# Altium schematic sheet PSU.SchDoc
size A4; SheetNumber: 3; SheetTotal: 7; SPICEModelCacheIJFRPAVB: <root> / <DocumentId>IJFRPAVB</DocumentId> / </root>
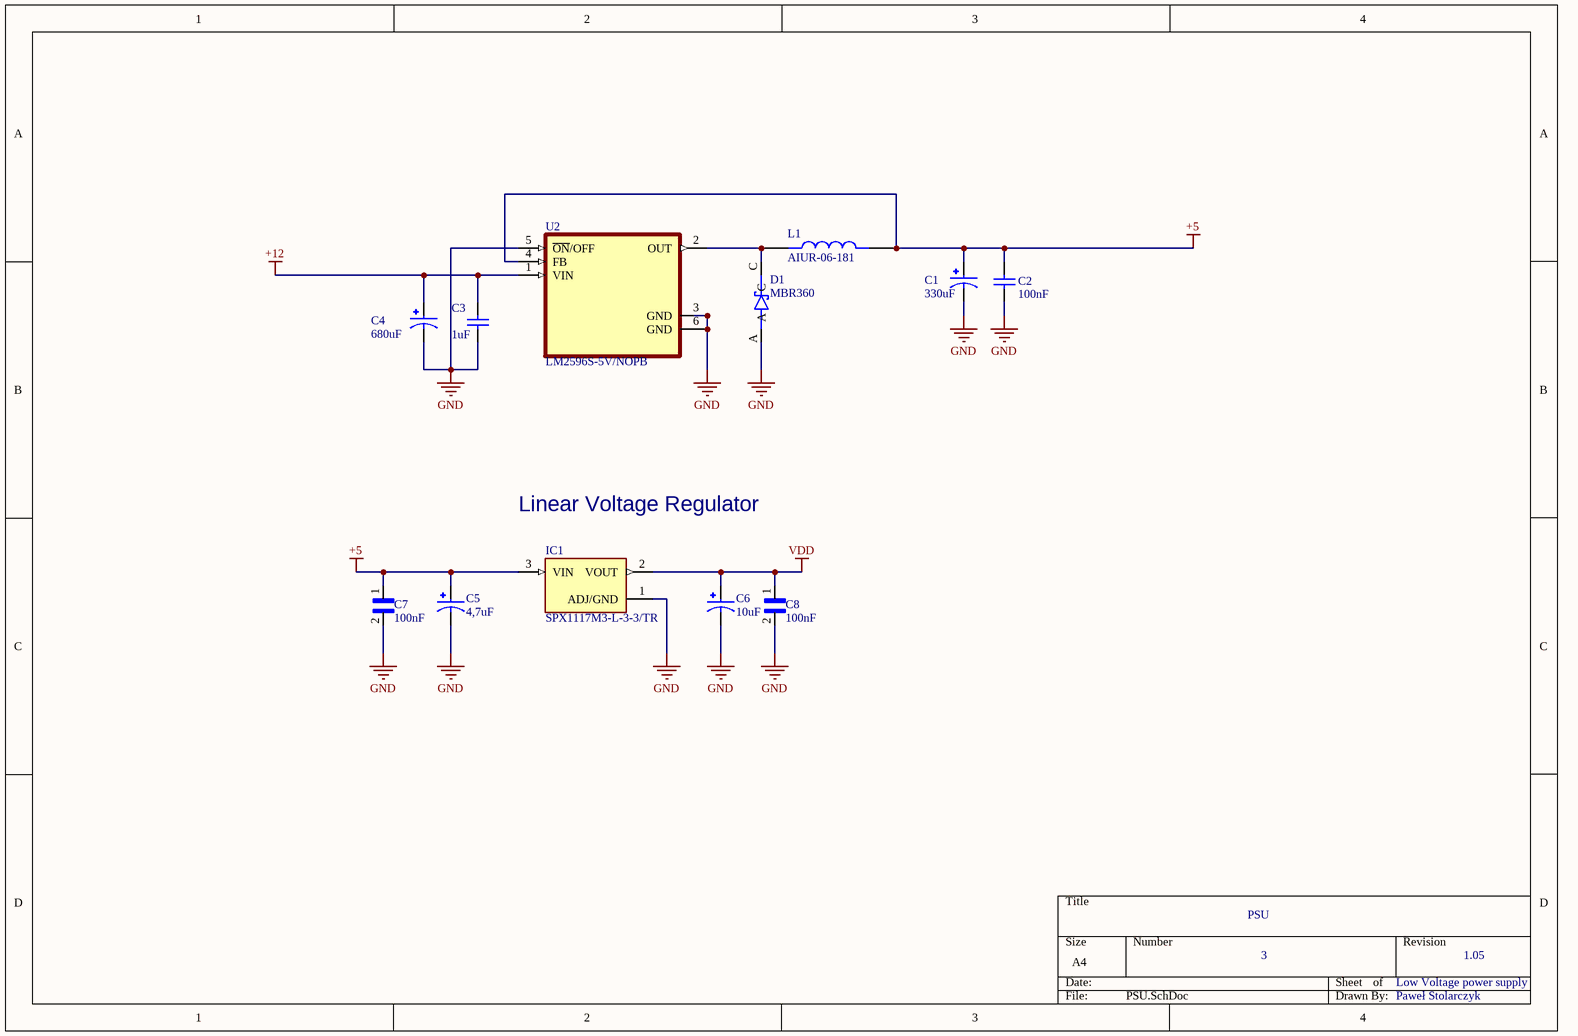
[diagram p0: PSU.SchDoc]

## Parts
C1  330uF  [CAP_16SVP330M]
C2  value 100nF  [0402]  (hidden comment: Cap)
C3  value 1uF  [0402]  (hidden comment: Cap)
C4  680uF  [CAP_16SVPC100M]
C5  4,7uF  [CAP_EEE1CA100SR]
C6  10uF  [CAP_EEE1CA100SR]
C7  100nF  [CAPC1608X90N]
C8  100nF  [CAPC1608X90N]
D1  MBR360  [DIOAD1950W125L950D560]
IC1  SPX1117M3-L-3-3/TR  [SOT230P700X180-3N]
L1  AIUR-06-181  [INDRD500W70D850H750]
U2  LM2596S-5V/NOPB  [VREG_LM2596S-ADJ/NOPB]

## Nets
+5: C1.1 C2.2 C5.1 C7.1 IC1.3(VIN) L1.2 U2.4(FB)
+12: C3.2 C4.1 U2.1(VIN)
GND: C1.2 C2.1 C3.1 C4.2 C5.2 C6.2 C7.2 C8.2 D1.A IC1.1(ADJ/GND) U2.3(GND) U2.5(~{ON}/OFF) U2.6(GND)
VDD: C6.1 C8.1 IC1.2(VOUT)
NetD1_C: D1.C L1.1 U2.2(OUT)

## Notes on the sheet
- Linear Voltage Regulator
- PSU
- 3
- Low Voltage power supply
- 1.05
- Paweł Stolarczyk

## Library data of the parts
C1 = 16SVP330M: Value: *; Package: None; Price: None; MP: 16SVP330M; Availability: Unavailable
C2 C3 = Cap: Capacitor; Published: 8-Jun-2000; LatestRevisionDate: 17-Jul-2002; LatestRevisionNote: Re-released for DXP Platform.; PackageReference: RAD-0.3; Publisher: Altium Limited; PackageDescription: Radial Cap, Thru-Hole; 2 Leads; 0.3 in Pin Spacing
C4 = 16SVPC100M: Package: None; MP: 16SVPC100M; Value: *; Price: None; Availability: Unavailable
C5 C6 = EEE1CA100SR: 10ÂµF 16V Aluminum Electrolytic Capacitors Radial, Can - SMD 2000 Hrs @ 85Â°C; MF: Panasonic; Digi-Key_Part_Number: PCE3878CT-ND; Check_prices: https://www.snapeda.com/parts/EEE1CA100SR/Panasonic/view-part/?ref=eda; Value: *; MP: EEE1CA100SR; Package: RADIAL-2 Panasonic; SnapEDA_Link: https://www.snapeda.com/parts/EEE1CA100SR/Panasonic/view-part/?ref=snap
C7 C8 = C0603C104J4RAC: 0.1ÂµF Â±5% 16V Ceramic Capacitor X7R 0603 (1608 Metric); MF: KEMET; MP: C0603C104J4RAC; SnapEDA_Link: https://www.snapeda.com/parts/C0603C104J4RAC/KEMET/view-part/1763758/?ref=snap; Availability: Warning; Package: 0603 KEMET; Check_prices: https://www.snapeda.com/parts/C0603C104J4RAC/KEMET/view-part/1763758/?ref=eda; Value: *; Price: None
D1 = MBR360: Diode Schottky 60V 3A Through Hole DO-201AD; MF: ON Semiconductor; MP: MBR360G; Check_prices: https://www.snapeda.com/parts/MBR360G/ON%20Semiconductor/view-part/53063/?ref=eda; Value: *; Price: None; Availability: Good; Package: AXIAL LEAD-2 ON Semiconductor; Purchase-URL: https://pricing.snapeda.com/search/part/MBR360G/?ref=eda; SnapEDA_Link: https://www.snapeda.com/parts/MBR360G/ON%20Semiconductor/view-part/53063/?ref=snap
IC1 = SPX1117M3-L-3-3/TR: Linear Voltage Regulator IC Positive Fixed 1 Output 800mA SOT-223; MF: MaxLinear, Inc.; Value: *; SnapEDA_Link: https://www.snapeda.com/parts/SPX1117M3-L-3-3/TR/MaxLinear%2C%20Inc./view-part/376705/?ref=snap; Package: SOT-223 Exar; MP: SPX1117M3-L-3-3/TR; Price: None; Availability: Unavailable
L1 = AIUR-06-181: FIXED IND 180UH 1.6A 228 MOHM TH; MF: Abracon LLC; Check_prices: https://www.snapeda.com/parts/AIUR-06-181/Abracon+LLC/view-part/?ref=eda; SnapEDA_Link: https://www.snapeda.com/parts/AIUR-06-181/Abracon+LLC/view-part/?ref=snap; Availability: In Stock; Value: *; Price: None; MP: AIUR-06-181; Package: Radial Abracon; Purchase-URL: https://pricing.snapeda.com/search/part/AIUR-06-181/?ref=eda
U2 = LM2596S-ADJ/NOPB: SIMPLE SWITCHER&reg; 4.5V to 40V, 3A Low Component Count Step-Down Regulator; MF: Texas Instruments; Price: None; Package: TO-263-5 Texas Instruments; Purchase-URL: https://pricing.snapeda.com/search/part/LM2596S-ADJ/NOPB/?ref=eda; Availability: In Stock; SnapEDA_Link: https://www.snapeda.com/parts/LM2596S-ADJ/NOPB/Texas+Instruments/view-part/?ref=snap; Value: *; MP: LM2596S-ADJ/NOPB; Check_prices: https://www.snapeda.com/parts/LM2596S-ADJ/NOPB/Texas+Instruments/view-part/?ref=eda